# EAGLE design 4thLPF (EAGLE 7.2.0)
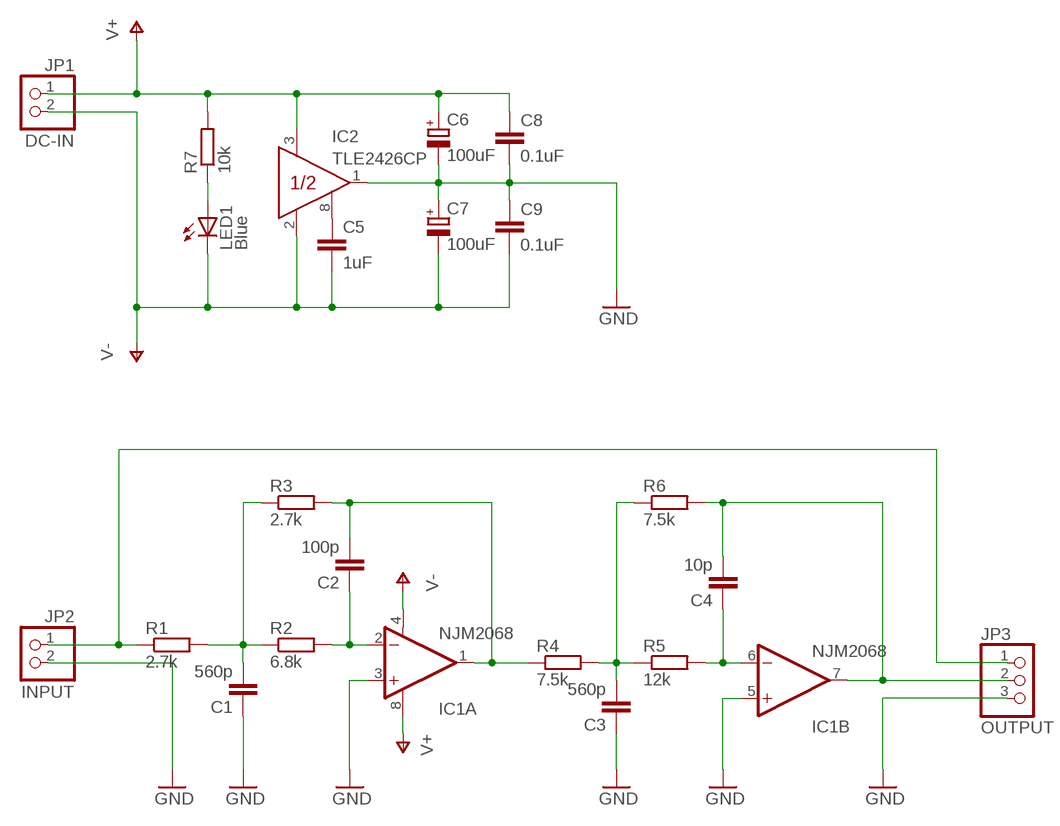
[diagram p0: schematic, sheet 1]

## Parts
C1  560p  C-EU050-035X075  [C050-035X075]
C2  100p  C-EU050-035X075  [C050-035X075]
C3  560p  C-EU050-035X075  [C050-035X075]
C4  10p  C-EU050-024X044  [C050-024X044]
C5  1uF  C-EU050-024X044  [C050-024X044]
C6  100uF  CPOL-EUE2.5-6  [E2,5-6]
C7  100uF  CPOL-EUE2.5-6  [E2,5-6]
C8  0.1uF  C-EU050-024X044  [C050-024X044]
C9  0.1uF  C-EU025-024X044  [C025-024X044]
IC1  NJM2068  OPA2134P  [DIL08]
IC2  TLE2426CP  [DIP-8]
JP1  DC-IN  PINHD-1X2  [1X02]
JP2  INPUT  PINHD-1X2  [1X02]
JP3  OUTPUT  PINHD-1X3  [1X03]
LED1  Blue  LED3MM  [LED3MM]
R1  2.7k  R-EU_0207/7  [0207/7]
R2  6.8k  R-EU_0207/7  [0207/7]
R3  2.7k  R-EU_0207/7  [0207/7]
R4  7.5k  R-EU_0207/7  [0207/7]
R5  12k  R-EU_0207/7  [0207/7]
R6  7.5k  R-EU_0207/7  [0207/7]
R7  10k  R-EU_0207/7  [0207/7]

## Nets
GND: C1.1 C3.1 C6.- C7.+ C8.2 C9.1 IC1.3(A:+IN) IC1.5(B:+IN) IC2.1(OUT) JP2.2 JP3.3
N$1: C1.2 R1.2 R2.1 R3.1
N$2: C2.1 IC1.2(A:-IN) R2.2
N$3: C4.1 IC1.6(B:-IN) R5.2
N$4: C2.2 IC1.1(A:OUT) R3.2 R4.1
N$5: JP2.1 JP3.1 R1.1
N$6: C3.2 R4.2 R5.1 R6.1
N$7: C4.2 IC1.7(B:OUT) JP3.2 R6.2
N$8: C5.1 IC2.8(NR)
N$9: LED1.A R7.1
V+: C6.+ C8.1 IC1.8(A:V+) IC2.3(IN) JP1.1 R7.2
V-: C5.2 C7.- C9.2 IC1.4(A:V-) IC2.2(COM) JP1.2 LED1.K(C)

## Library data of the parts
C1-C5 C8 C9 = rcl:C-EU: CAPACITOR, European symbol
C6 C7 = rcl:CPOL-EU: POLARIZED CAPACITOR, European symbol
IC1 = burr-brown:OPA2134: Operational Amplifier; MF: TEXAS INSTRUMENTS; MPN: OPA2134PA; OC_FARNELL: 1097574; OC_NEWARK: 74K3897
IC2 = tle2426:TLE2426*: Texas Instruments "rail splitter" with noise-reduction
JP1 JP2 = pinhead:PINHD-1X2: PIN HEADER
JP3 = pinhead:PINHD-1X3: PIN HEADER
LED1 = led:LED: LED OSRAM: - CHIPLED LG R971, LG N971, LY N971, LG Q971, LY Q971, LO R971, LY R971 LH N974, LH R974 LS Q976, LO Q976, LY Q976 LO Q996 - Hyper CHIPLED LW Q18S LB Q993, LB Q99A, LB R99A - SideLED LS A670, LO A670, LY A670, LG A670, LP A670 LB A673, LV A673, LT A673, LW A673 LH A674 LY A675 LS A676, LA A676, LO A676, LY A676, LW A676 LS A679, LY A679, LG A679 - Hyper Micro SIDELED® LS Y876, LA Y876, LO Y876, LY Y876 LT Y87S - SmartLED LW L88C, LW L88S LB L89C, LB L89S, LG L890 LS L89K, LO L89K, LY L89K LS L896, LA L896, LO L896, LY L896 - TOPLED LS T670, LO T670, LY T670, LG T670, LP T670 LSG T670, LSP T670, LSY T670, LOP T670, LYG T670 LG T671, LOG T671, LSG T671 LB T673, LV T673, LT T673, LW T673 LH T674 LS T676, LA T676, LO T676, LY T676, LB T676, LH T676, LSB T676, LW T676 LB T67C, LV T67C, LT T67C, LS T67K, LO T67K, LY T67K, LW E67C LS E67B, LA E67B, LO E67B, LY E67B, LB E67C, LV E67C, LT E67C LW T67C LS T679, LY T679, LG T679 LS T770, LO T770, LY T770, LG T770, LP T770 LB T773, LV T773, LT T773, LW T773 LH T774 LS E675, LA E675, LY E675, LS T675 LS T776, LA T776, LO T776, LY T776, LB T776 LHGB T686 LT T68C, LB T68C - Hyper Mini TOPLED® LB M676 - Mini TOPLED Santana® LG M470 LS M47K, LO M47K, LY M47K Source: http://www.osram.convergy.de LUXEON: - LUMILED® LXK2-PW12-R00, LXK2-PW12-S00, LXK2-PW14-U00, LXK2-PW14-V00 LXK2-PM12-R00, LXK2-PM12-S00, LXK2-PM14-U00 LXK2-PE12-Q00, LXK2-PE12-R00, LXK2-PE12-S00, LXK2-PE14-T00, LXK2-PE14-U00 LXK2-PB12-K00, LXK2-PB12-L00, LXK2-PB12-M00, LXK2-PB14-N00, LXK2-PB14-P00, LXK2-PB14-Q00 LXK2-PR12-L00, LXK2-PR12-M00, LXK2-PR14-Q00, LXK2-PR14-R00 LXK2-PD12-Q00, LXK2-PD12-R00, LXK2-PD12-S00 LXK2-PH12-R00, LXK2-PH12-S00 LXK2-PL12-P00, LXK2-PL12-Q00, LXK2-PL12-R00 Source: www.luxeon.com KINGBRIGHT: KA-3528ASYC Source: www.kingbright.com
R1-R7 = rcl:R-EU_: RESISTOR, European symbol

## Board
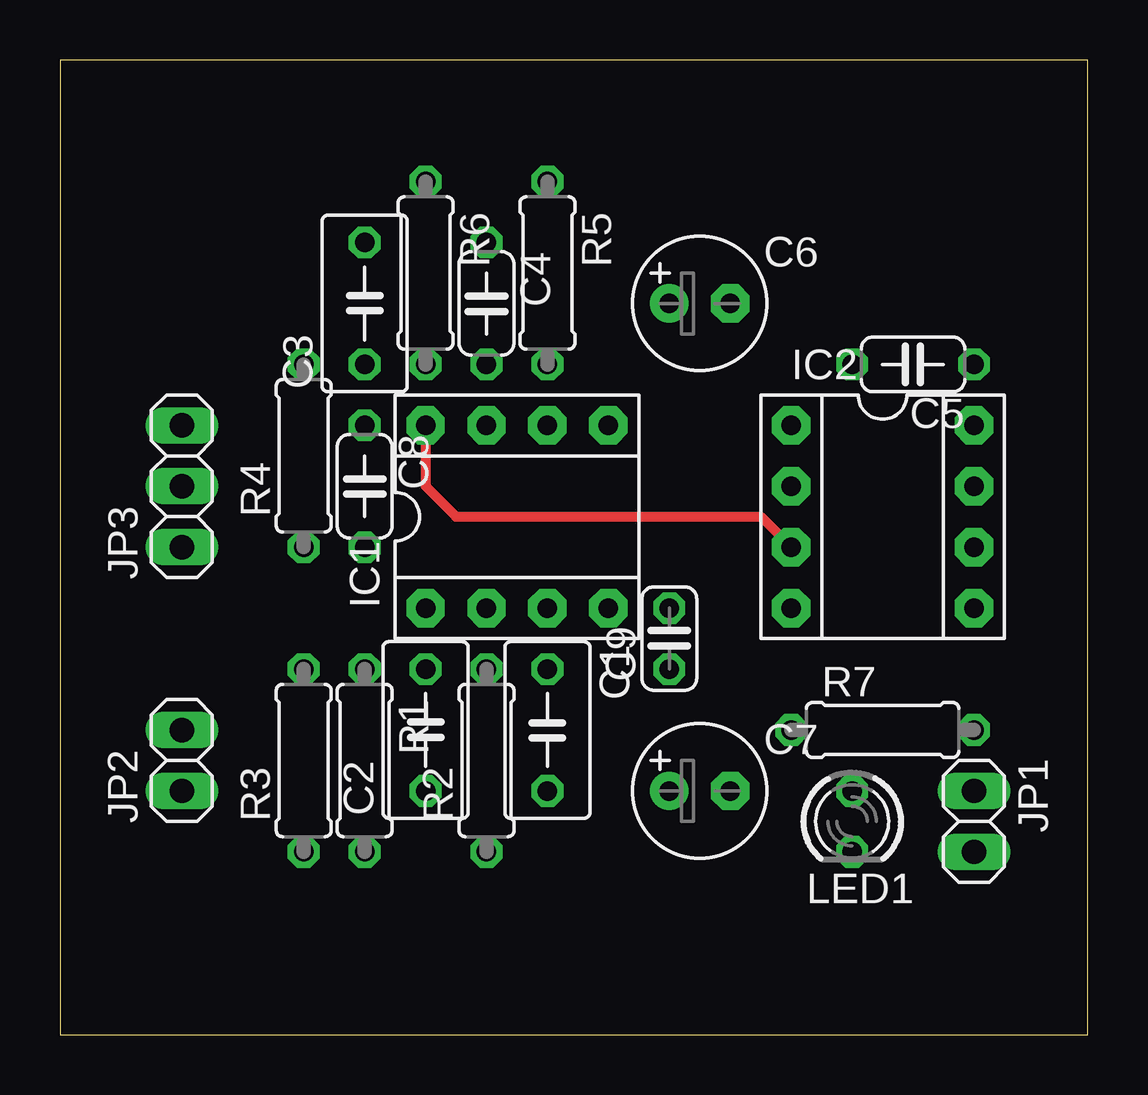
[diagram p1: board, top side]
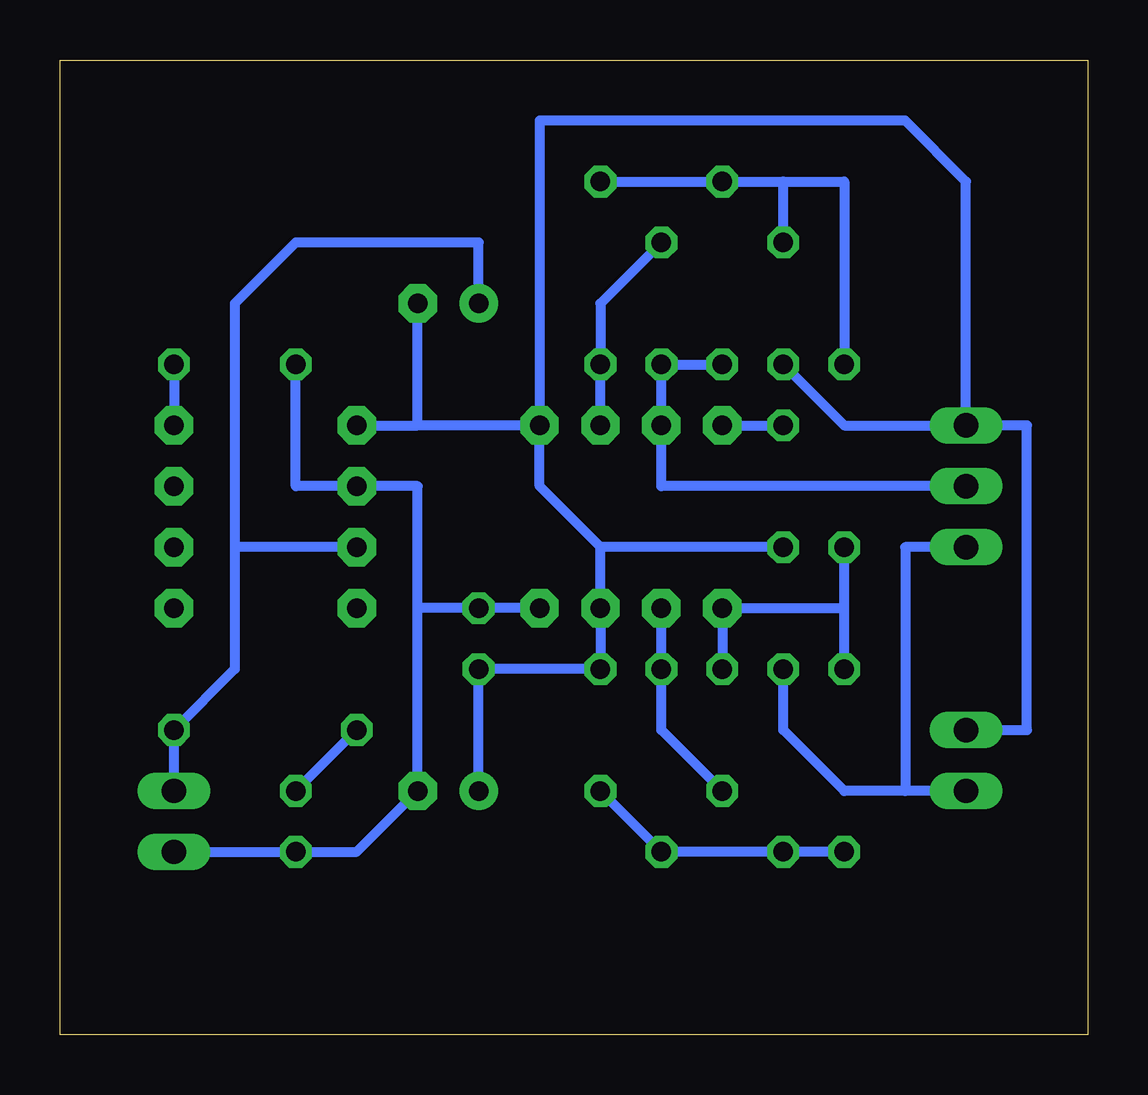
[diagram p2: board, bottom side, seen from below]

Size 42.85 x 40.63 mm. Coordinates in mm from the lower left corner, seen from the top.
Outline: 0,0 42.85,0 42.85,40.63 0,40.63 0,0
Copper layers (1*16): Top 0.035mm / dielectric 1.5mm / Bottom 0.035mm
Design rules "default": minimum track width 10mil, minimum drill 24mil, track to track 8mil, track to pad 8mil, pad to pad 8mil, via to via 8mil, smd to smd 8mil, copper to edge 40mil, drill to drill 8mil, minimum pad ring 10mil, minimum via ring 8mil, stop-mask expansion 4mil, vias tented up to drill 0mil, thermal gap 10mil

### Footprints (pad centres in the part's own frame; a part is rotated, then mirrored left to right if it is on the bottom)
C050-035X075 = drill 0.813 octagon: 1 -2.54,0; 2 2.54,0
C050-024X044 = drill 0.813 octagon: 1 -2.54,0; 2 2.54,0
E2,5-6 = drill 0.813 pad 1.6: + -1.27,0 | drill 0.813 pad 1.6 octagon: - 1.27,0
C025-024X044 = drill 0.813 octagon: 1 -1.27,0; 2 1.27,0
DIL08 = drill 0.813 pad 1.6 octagon: 1 -3.81,-3.81; 2 -1.27,-3.81; 3 1.27,-3.81; 4 3.81,-3.81; 5 3.81,3.81; 6 1.27,3.81; 7 -1.27,3.81; 8 -3.81,3.81
DIP-8 = drill 0.813 pad 1.6 octagon: 1 -3.81,3.81; 2 -3.81,1.27; 3 -3.81,-1.27; 4 -3.81,-3.81; 5 3.81,-3.81; 6 3.81,-1.27; 7 3.81,1.27; 8 3.81,3.81
1X02 = drill 1.016 long: 1 -1.27,0; 2 1.27,0
1X03 = drill 1.016 long: 1 -2.54,0; 2 0,0; 3 2.54,0
LED3MM = drill 0.813 octagon: A -1.27,0; K 1.27,0
0207/7 = drill 0.813 octagon: 1 -3.81,0; 2 3.81,0

### Placement (x,y rotation side)
C1  20.32,12.7 270 top
C2  15.24,12.7 90 top
C3  12.7,30.48 90 top
C4  17.78,30.48 270 top
C5  35.56,27.94 180 top
C6  26.67,30.48 0 top
C7  26.67,10.16 0 top
C8  12.7,22.86 270 top
C9  25.4,16.51 90 top
IC1  19.05,21.59 0 top
IC2  34.29,21.59 0 top
JP1  38.1,8.89 270 top
JP2  5.08,11.43 90 top
JP3  5.08,22.86 90 top
LED1  33.02,8.89 270 top
R1  12.7,11.43 270 top
R2  17.78,11.43 90 top
R3  10.16,11.43 90 top
R4  10.16,24.13 90 top
R5  20.32,31.75 270 top
R6  15.24,31.75 270 top
R7  34.29,12.7 0 top

### Tracks (layer width: path | path; a pad name or v marks a point on that pad's centre or on a via)
GND
  Bottom 0.406: C8.2 20.32,20.32 | 20.32,20.32 22.86,22.86 IC1.5 | 20.32,20.32 IC1.3 C1.1 C9.1 C7.+ | IC2.1 27.94,25.4 | 27.94,25.4 C6.- | IC1.5 27.94,25.4 | IC1.5 22.86,38.1 7.62,38.1 5.08,35.56 JP3.3 | JP2.2 2.54,12.7 2.54,25.4 JP3.3 | C3.1 10.16,25.4 JP3.3
N$1
  Bottom 0.406: R3.1 R1.2 R2.1 C1.2
N$2
  Bottom 0.406: IC1.2 R2.2 17.78,12.7 C2.1
N$3
  Bottom 0.406: IC1.6 R5.2 20.32,30.48 C4.1
N$4
  Bottom 0.406: R3.2 10.16,17.78 | 10.16,17.78 R4.1 | 10.16,17.78 IC1.1 C2.2
N$5
  Bottom 0.406: JP2.1 7.62,10.16 | 7.62,10.16 10.16,10.16 12.7,12.7 R1.1 | JP3.1 7.62,20.32 7.62,10.16
N$6
  Bottom 0.406: R5.1 R6.1 12.7,35.56 | 12.7,35.56 10.16,35.56 R4.2 | C3.2 12.7,35.56
N$7
  Bottom 0.406: R6.2 C4.2 IC1.7 17.78,22.86 JP3.2
N$8
  Bottom 0.406: C5.1 IC2.8
N$9
  Bottom 0.406: LED1.A R7.1
V+
  Top 0.406: IC1.8 15.24,22.86 16.51,21.59 29.21,21.59 IC2.3
  Bottom 0.406: IC1.8 C8.1 | JP1.1 R7.2 35.56,15.24 35.56,20.32 | C6.+ 25.4,33.02 33.02,33.02 35.56,30.48 35.56,20.32 | IC2.3 35.56,20.32
V-
  Bottom 0.406: IC1.4 C9.2 27.94,17.78 | 27.94,17.78 C7.- 30.48,7.62 LED1.K JP1.2 | 27.94,17.78 27.94,22.86 IC2.2 33.02,22.86 C5.2